# EAGLE schematic PeripheralDriver (EAGLE 5.10)
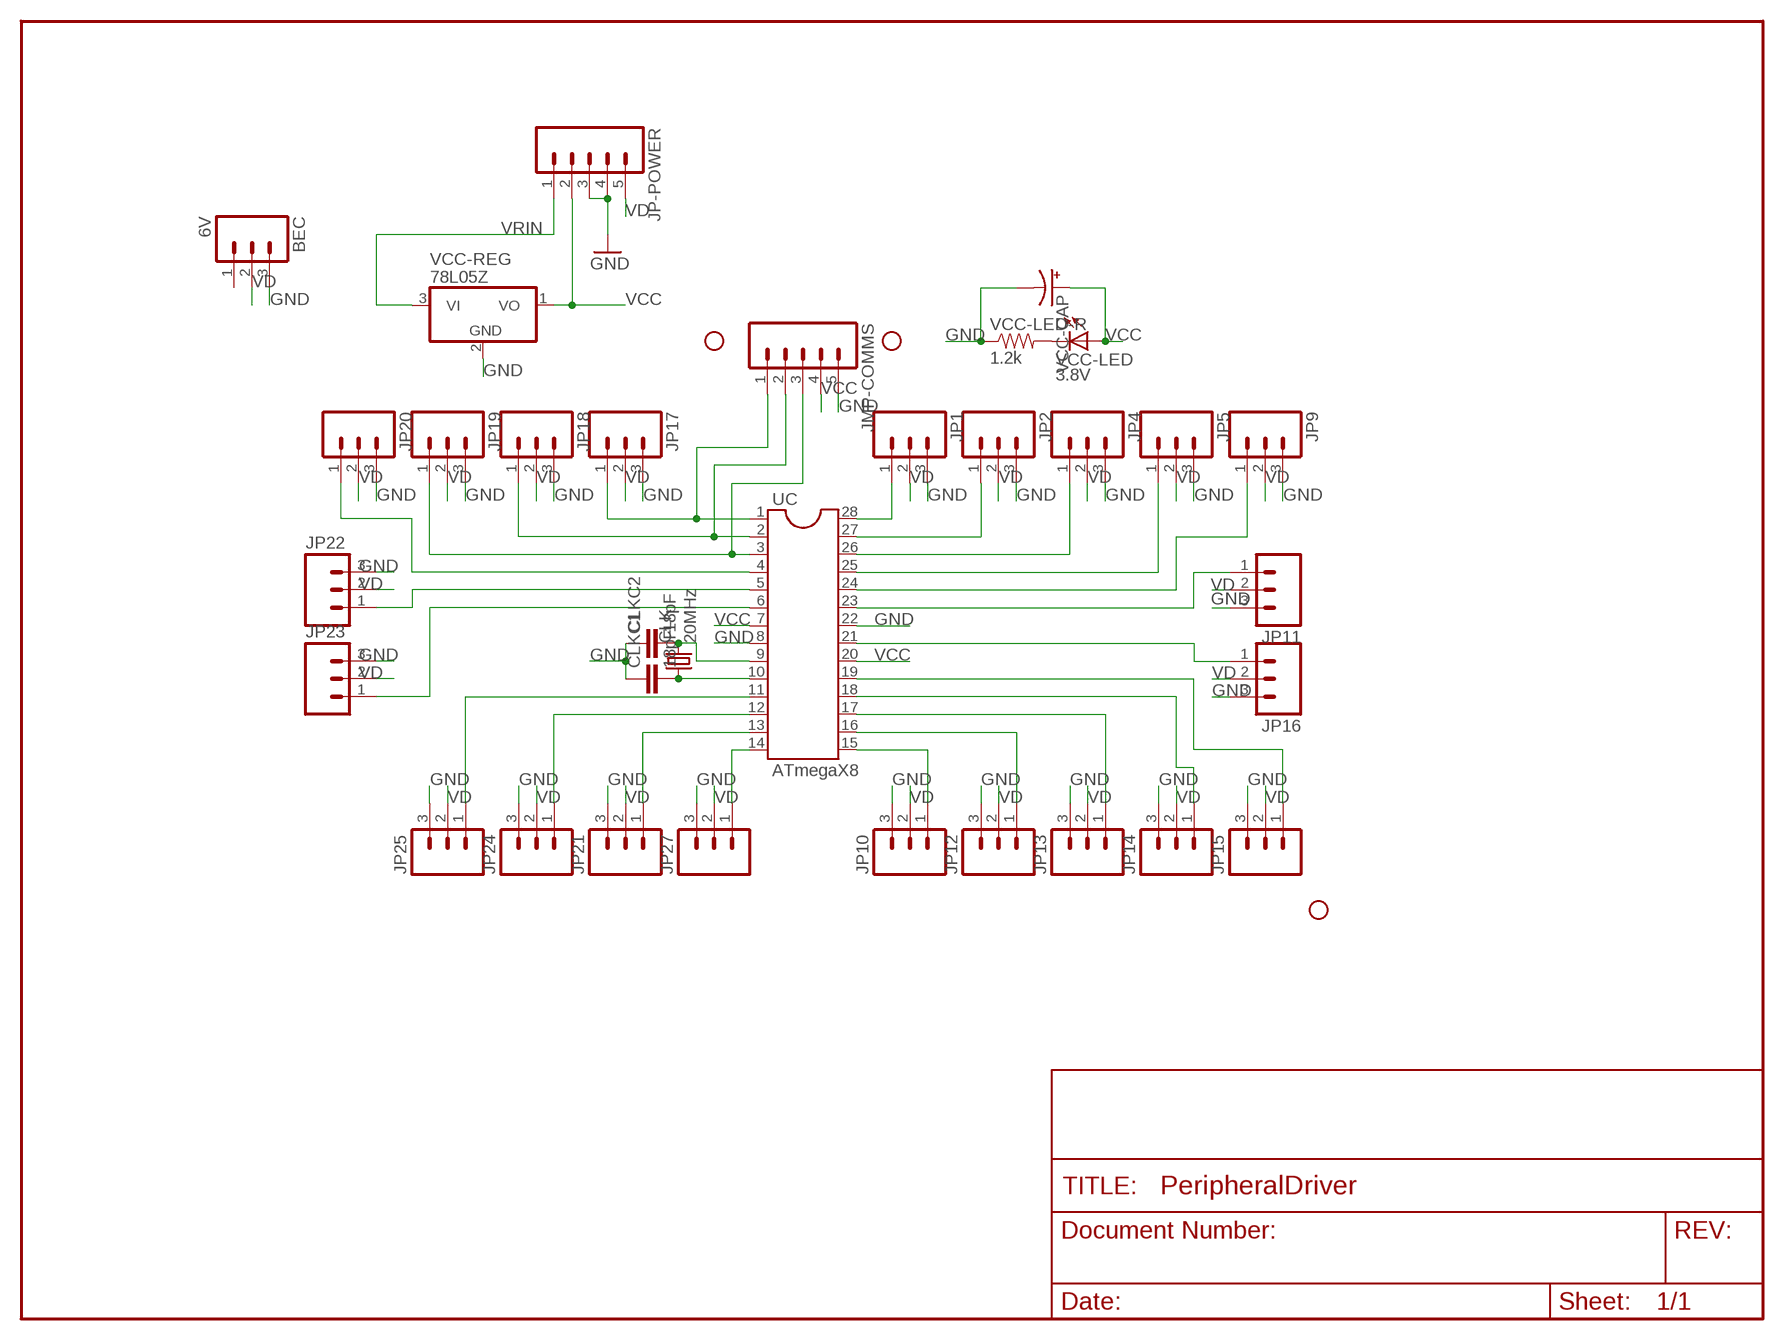
[diagram p0: schematic, sheet 1]

## Parts
BEC  6V  M03LOCK  [1X03_LOCK]
CLK  20MHz  CRYSTALHC49S  [HC49/S]
CLKC1  18pF  CAPPTH  [CAP-PTH-SMALL]
CLKC2  18pF  CAPPTH  [CAP-PTH-SMALL]
JMP-COMMS  M05LOCK  [1X05_LOCK]
JP1  M03LOCK  [1X03_LOCK]
JP2  M03LOCK  [1X03_LOCK]
JP4  M03LOCK  [1X03_LOCK]
JP5  M03LOCK  [1X03_LOCK]
JP7  STAND-OFF  [STAND-OFF]
JP9  M03LOCK  [1X03_LOCK]
JP10  M03LOCK  [1X03_LOCK]
JP11  M03LOCK  [1X03_LOCK]
JP12  M03LOCK  [1X03_LOCK]
JP13  M03LOCK  [1X03_LOCK]
JP14  M03LOCK  [1X03_LOCK]
JP15  M03LOCK  [1X03_LOCK]
JP16  M03LOCK  [1X03_LOCK]
JP17  M03LOCK  [1X03_LOCK]
JP18  M03LOCK  [1X03_LOCK]
JP19  M03LOCK  [1X03_LOCK]
JP20  M03LOCK  [1X03_LOCK]
JP21  M03LOCK  [1X03_LOCK]
JP22  M03LOCK  [1X03_LOCK]
JP23  M03LOCK  [1X03_LOCK]
JP24  M03LOCK  [1X03_LOCK]
JP25  M03LOCK  [1X03_LOCK]
JP27  M03LOCK  [1X03_LOCK]
JP29  STAND-OFF  [STAND-OFF]
JP30  STAND-OFF  [STAND-OFF]
JP-POWER  M05LOCK  [1X05_LOCK]
UC  ATmegaX8  DIL28-3  [DIL28-3]
VCC-CAP  CAP_POLPTH1  [CPOL-RADIAL-100UF-25V]
VCC-LED  3.8V  LED3MM  [LED3MM]
VCC-LED-R  1.2k  RESISTORPTH1  [AXIAL-0.3]
VCC-REG  78L05Z  [TO92]

## Nets
GND [Power]: BEC.3 CLKC1.1 CLKC2.1 JMP-COMMS.5 JP1.3 JP2.3 JP4.3 JP5.3 JP9.3 JP10.3 JP11.3 JP12.3 JP13.3 JP14.3 JP15.3 JP16.3 JP17.3 JP18.3 JP19.3 JP20.3 JP21.3 JP22.3 JP23.3 JP24.3 JP25.3 JP27.3 JP-POWER.3 JP-POWER.4 UC.8 UC.22 VCC-CAP.2(-) VCC-LED-R.P$1 VCC-REG.2(GND)
N$1: CLK.2 CLKC2.2 UC.9
N$2: JP22.1 UC.5
N$3: JP12.1 UC.16
N$4: JP10.1 UC.15
N$5: JP16.1 UC.21
N$6: JP15.1 UC.19
N$7: VCC-LED-R.P$2 VCC-LED.K(C)
N$8: JP13.1 UC.17
N$9: JP11.1 UC.23
N$10: JP9.1 UC.24
N$11: JP5.1 UC.25
N$12: JP4.1 UC.26
N$14: JP27.1 UC.14
N$16: CLK.1 CLKC1.2 UC.10
N$17: JP2.1 UC.27
N$18: JP1.1 UC.28
N$19: JP20.1 UC.4
N$20: JP21.1 UC.13
N$21: JP24.1 UC.12
N$25: JP23.1 UC.6
N$26: JP25.1 UC.11
N$35: JP14.1 UC.18
RST: JMP-COMMS.1 JP17.1 UC.1
RXD: JMP-COMMS.2 JP18.1 UC.2
TXD: JMP-COMMS.3 JP19.1 UC.3
VCC: JMP-COMMS.4 JP-POWER.2 UC.7 UC.20 VCC-CAP.1(+) VCC-LED.A VCC-REG.1(VO)
VD [Power]: BEC.2 JP1.2 JP2.2 JP4.2 JP5.2 JP9.2 JP10.2 JP11.2 JP12.2 JP13.2 JP14.2 JP15.2 JP16.2 JP17.2 JP18.2 JP19.2 JP20.2 JP21.2 JP22.2 JP23.2 JP24.2 JP25.2 JP27.2 JP-POWER.5
VRIN: JP-POWER.1 VCC-REG.3(VI)
Unconnected: BEC.1

## Library data of the parts
BEC JP1 JP2 JP4 JP5 JP9-JP25 JP27 = SparkFun:M03: Header 3 Standard 3-pin 0.1" header. Use with straight break away headers (SKU : PRT-00116), right angle break away headers (PRT-00553), swiss pins (PRT-00743), machine pins (PRT-00117), and female headers (PRT-00115). Molex polarized connector foot print use with SKU : PRT-08232 with associated crimp pins and housings.
CLK = crystal:CRYSTAL: CRYSTAL
CLKC1 CLKC2 = SparkFun:CAP: Capacitor Standard 0603 ceramic capacitor, and 0.1" leaded capacitor.
JMP-COMMS JP-POWER = SparkFun:M05: Header 5 Standard 5-pin 0.1" header. Use with straight break away headers (SKU : PRT-00116), right angle break away headers (PRT-00553), swiss pins (PRT-00743), machine pins (PRT-00117), and female headers (PRT-00115). Molex polarized connector foot print use with SKU : PRT-08230 with associated crimp pins and housings.
JP7 JP29 JP30 = SparkFun:STAND-OFF: Stand Off This is the mechanical footprint for a #4 phillips button head screw. Use the keepout ring to avoid running the screw head into surrounding components. SKU : PRT-00447
UC = ic-package:DIL28: Dual In Line
VCC-CAP = SparkFun:CAP_POL: Capacitor Polarized These are standard SMD and PTH capacitors. Normally 10uF, 47uF, and 100uF in electrolytic and tantalum varieties. Always verify the external diameter of the through hole cap, it varies with capacity, voltage, and manufacturer. The EIA devices should be standard.
VCC-LED = SparkFun:LED: LEDs Standard schematic elements and footprints for 5mm, 3mm, 1206, and 0603 sized LEDs. 5mm - Spark Fun Electronics SKU : COM-00529 (and others)
VCC-LED-R = SparkFun:RESISTOR: Resistor Basic schematic elements and footprints for 0603, 1206, and PTH 1/10th watt (small) resistors.
VCC-REG = linear:78*: Positive VOLTAGE REGULATOR Source: http://cache.national.com/ds/LM/LM78L05.pdf http://www.fairchildsemi.com/ds/LM/LM7805.pdf

## Net classes
1 Power: width 0.508 mm